# EasyEDA Pro project Temp_Con_V116.eprj, board TEMP_PWR
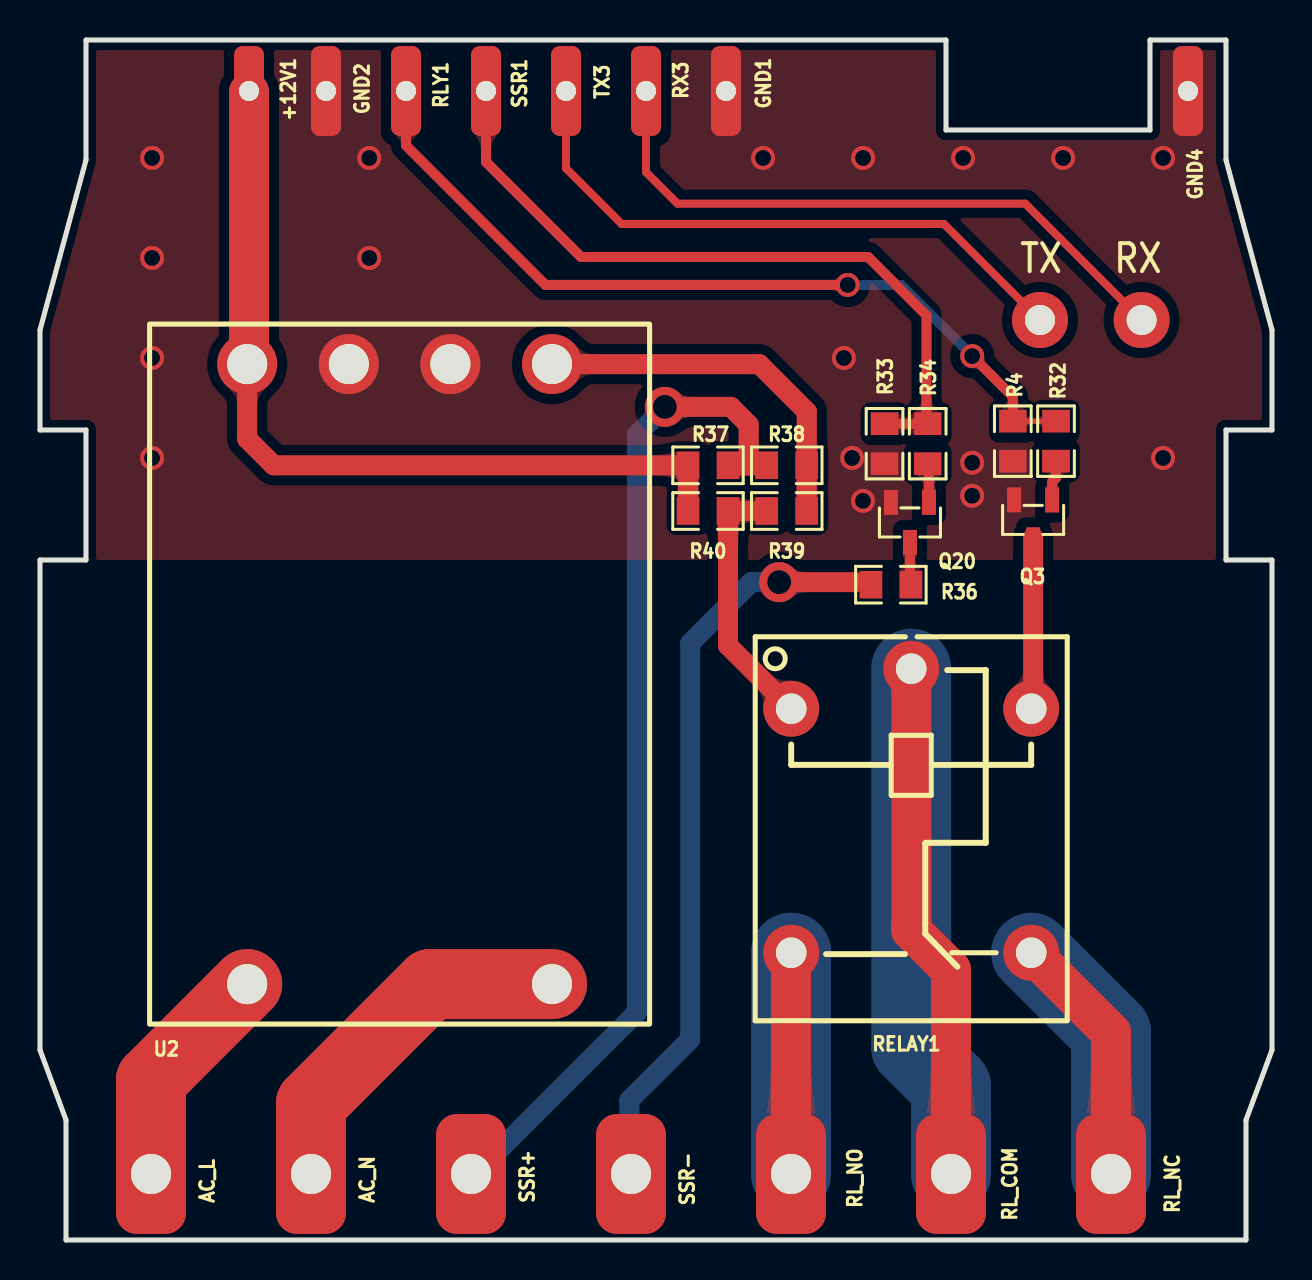
[diagram p10: board, top side]
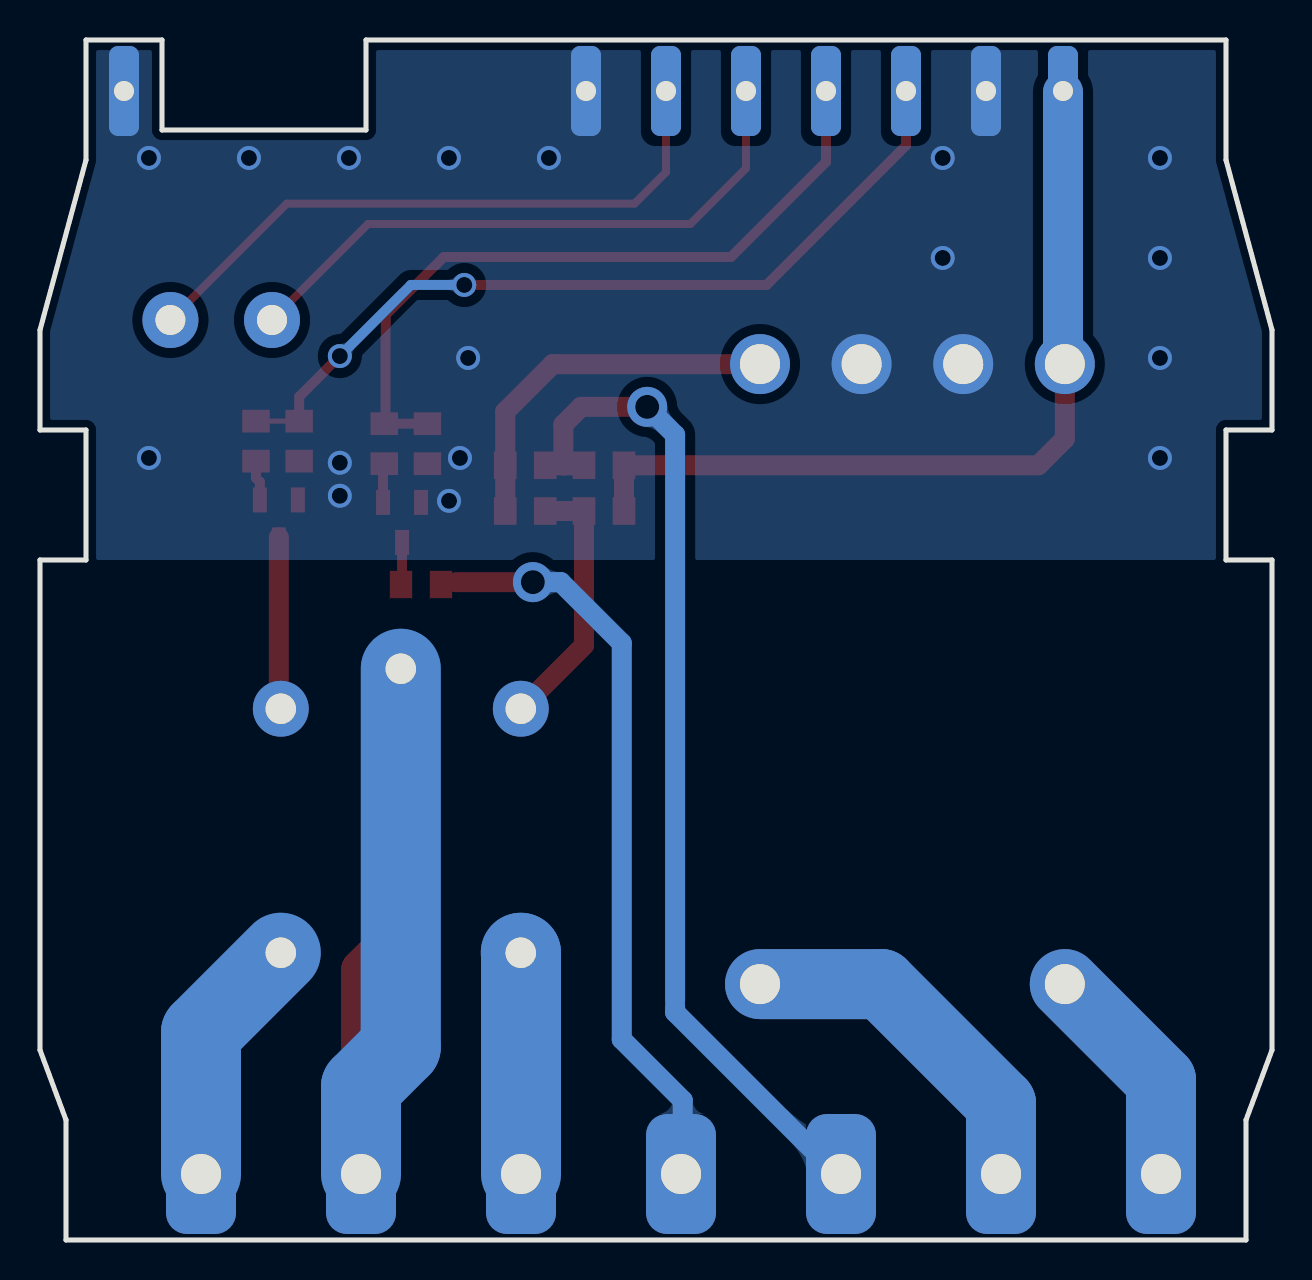
[diagram p11: board, bottom side, seen from below]

Outline 61.6 x 60 mm; copper layers: Top Layer, Bottom Layer. Coordinates in mm from the lower left corner of the outline.
Outline path: 0,45.5 0,40.5 2.3,40.5 2.3,34 0,34 0,9.5 1.3,6 1.3,0 60.3,0 60.3,6 61.6,9.5 61.6,34 59.3,34 59.3,40.5 61.6,40.5 61.6,45.5 59.3,54 59.3,60 55.5,60 55.5,55.5 45.3,55.5 45.3,60 2.3,60 2.3,54 0,45.5
Stack: Top Layer 0.035mm / Dielectric1 1.51mm FR4 er 4.5 / Bottom Layer 0.035mm

## Design rules (mm)
template: Custom Config
spacing copperThickness1oz (default): track to track 0.203, other pairs 0.201 to 0.305
track width copperThickness1oz (default): min 0.127, default 0.254, max 5
track width copperThickness2oz: min 0.203, default 0.254, max 2.54
differential pair differentialPair (default): width min 0.127, default 0.254, max 2.54; gap min 0.152, default 0.152
via viaSize (default): diameter min 0.5, default 0.8, max 10; hole min 0.5, default 0.5, max 10

## Placement (name value [footprint] x y rotation side)
+12V1  -  [S_FT]  10.45 57.45 180 top
AC_L  -  [B_FT]  5.55 3.3 0 top
AC_N  -  [B_FT]  13.55 3.3 0 top
GND1  -  [S_FT]  34.3 57.45 180 top
GND2  -  [S_FT]  14.3 57.45 180 top
GND4  -  [S_FT]  57.4 57.45 0 top
NOREF  -  [Pad_e107]  55.08 46 0 top
NOREF#2  -  [Pad_e106]  50 46 0 top
Q3  AO3400A  [SOT-23-3_L2.9-W1.3-P1.90-LS2.4-BR]  49.66 36 90 top
Q20  AO3400A  [SOT-23-3_L2.9-W1.3-P1.90-LS2.4-BR]  43.5 35.88 90 top
R4  10kΩ  [R0805]  48.64 39.94 90 top
R32  1kΩ  [R0805]  50.8 39.94 90 top
R33  10kΩ  [R0805]  42.23 39.81 90 top
R34  1kΩ  [R0805]  44.39 39.81 90 top
R36  0Ω  [R0805]  42.54 32.77 180 top
R37  0Ω  [R0805]  33.4 38.73 180 top
R38  0Ω  [R0805]  37.34 38.73 0 top
R39  0Ω  [R0805]  37.34 36.45 0 top
R40  0Ω  [R0805]  33.4 36.45 180 top
RELAY1  SRD-12VDC-SL-C  [RELAY-TH_SRD-XXVDC-XL-C]  43.56 21.46 270 top
RL_COM  -  [B_FT]  45.55 3.3 0 top
RL_NC  -  [B_FT]  53.55 3.3 0 top
RL_NO  -  [B_FT]  37.55 3.3 0 top
RLY1  -  [S_FT]  18.3 57.45 180 top
RX3  -  [S_FT]  30.3 57.45 180 top
SSR1  -  [S_FT]  22.3 57.45 180 top
SSR+  -  [B_FT]  21.55 3.3 0 top
SSR-  -  [B_FT]  29.55 3.3 0 top
TX3  -  [S_FT]  26.3 57.45 180 top
U2  -  [P_MOD1]  30.48 10.79 90 top

## Footprints (pads in the part's own frame, mm; a bottom-side part is the same pattern mirrored in y, then rotated)
B_FT
  rrect 3.5x6 hole 2x1.5: 1(0,0)
P_MOD1
  round 3 hole 2: 1(2,20.12) 2(2,4.88) 3(33,4.88) 4(33,9.96) 5(33,15.04) 6(33,20.12)
Pad_e106
  round 2.8 hole 1.5: 1(0,0)
Pad_e107
  round 2.8 hole 1.5: 2(0,0)
R0805
  rect 1.133x1.377 smd: 1(-1,0) 2(1,0)
RELAY-TH_SRD-XXVDC-XL-C
  round 2.794 hole 1.524: 1(-5.1,-6) 2(7.1,-6) 3(7.1,6) 4(-5.1,6) 5(-7.1,0)
S_FT
  rrect 1.5x4.5 hole 1: 1(0,0)
SOT-23-3_L2.9-W1.3-P1.90-LS2.4-BR
  rect 1.25x0.7 smd: 1(1,-0.95) 2(1,0.95) 3(-1,0)

## Nets
As in the schematic, except:
U3_RX: NOREF.2 RX3.1
U3_TX: NOREF#2.1 TX3.1

## Via types
v1: diameter 1.2, hole 0.8, Top Layer to Bottom Layer, 19 vias
v2: diameter 2, hole 1.2, Top Layer to Bottom Layer, 2 vias

## Routing (per net, layer and track width the routed paths; a pad name or vN(x,y) marks a point on that pad's centre or on a via; arc(x,y) is an arc through that point)
+5V: length 18.7
  Top Layer w1: 25.6,43.8 35.96,43.8 38.34,41.42 R38.2 R39.2
+12V: length 55.9
  Top Layer w1: 32.38,36.47 R40.2 R37.2 11.68,38.73 10.36,40.06 10.36,43.8
  Top Layer w2: 10.45,57.4 10.45,43.89 10.36,43.8
  Bottom Layer w2: 10.36,43.8 10.45,43.89 10.45,57.4
GND:
  vias: v1(5.6,54.1) v1(5.6,49.1) v1(5.6,44.1) v1(5.6,39.1) v1(16.46,54.1) v1(16.46,49.1) v1(36.15,54.1) v1(40.19,44.1) v1(40.6,39.1) v1(41.15,36.96) v1(41.15,54.1) v1(46.15,54.1) v1(46.61,38.86) v1(46.61,37.21) v1(51.15,54.1) v1(56.15,54.1) v1(56.15,39.1)
AC_L: length 23
  Top Layer w3.5: AC_L.1 5.55,7.99 10.36,12.8
  Bottom Layer w3.5: AC_L.1 5.55,7.99 10.36,12.8
AC_N: length 36.1
  Top Layer w3.5: AC_N.1 13.55,6.82 19.53,12.8 25.6,12.8
  Bottom Layer w3.5: 25.6,12.8 19.53,12.8 13.55,6.82 AC_N.1
RL_COM: length 52.2
  Top Layer w2: 43.56,28.56 43.56,15.49 45.55,13.5 RL_COM.1
  Bottom Layer w4: 43.56,28.56 43.56,9.65 45.55,7.66 RL_COM.1
RL_NC: length 25.4
  Top Layer w2: RELAY1.3 53.55,10.37 RL_NC.1
  Bottom Layer w4: RELAY1.3 53.55,10.37 RL_NC.1
RL_NO: length 22.1
  Top Layer w2: RELAY1.2 37.55,14.35 RL_NO.1
  Bottom Layer w4: RELAY1.2 37.55,14.35 RL_NO.1
RLY: length 41.7
  Top Layer w0.254: R4.2 R32.2
  Top Layer w0.5: RLY1.1 18.3,54.72 25.27,47.75 v1(40.39,47.75) ; R4.2 48.64,42.16 v1(46.61,44.2)
  Bottom Layer w0.5: v1(46.61,44.2) 43.05,47.75 v1(40.39,47.75)
SSR: length 36.7
  Top Layer w0.5: SSR1.1 22.3,53.9 27.05,49.15 41.41,49.15 44.32,46.23 44.32,41.2 43.94,40.81 ; 43.94,40.81 R34.2 ; 43.94,40.81 R33.2 ; 43.94,40.81 43.94,40.62
SSR+: length 50.7
  Top Layer w1: R37.1 35.43,38.73 ; 35.43,38.73 35.43,40.77 34.54,41.66 v2(31.24,41.66) ; 35.43,38.73 R38.1
  Bottom Layer w1: v2(31.24,41.66) 29.84,40.26 29.84,11.98 ; SSR+.1 21.76,3.3 29.84,11.39 29.84,11.68
SSR-: length 37.4
  Top Layer w1: 40.78,32.89 v2(36.96,32.89)
  Bottom Layer w1: SSR-.1 29.46,3.39 29.46,6.99 32.51,10.03 32.51,29.84 35.56,32.89 v2(36.96,32.89)
U3_RX: length 31.9
  Top Layer w0.4: NOREF.2 49.26,51.82 31.88,51.82 30.3,53.39 RX3.1
U3_TX: length 30.7
  Top Layer w0.4: TX3.1 26.3,53.58 29.08,50.8 45.2,50.8 NOREF#2.1
$1N448: length 8.6
  Top Layer w1: 49.66,35.13 49.66,26.66 49.56,26.56
$1N449: length 13.2
  Top Layer w1: 37.56,26.56 34.4,29.72 34.4,36.17 34.68,36.45 ; 34.68,36.45 R39.1 ; 34.68,36.45 R40.1
$1N452: length 2
  Top Layer w0.5: 50.61,37.13 50.61,37.91 50.8,38.1 50.8,39
$1N459: length 2
  Top Layer w0.5: Q20.1 44.45,38.75 R34.1
$1N1061: length 2.1
  Top Layer w0.5: R36.1 43.5,32.81 Q20.3

## Copper pours and planes (outline as drawn; the poured copper is in the pictures)
GND on Top Layer: 0,45.5 0,40.5 2.3,40.5 2.3,34 59.3,34 59.3,40.5 61.6,40.5 61.6,45.5 59.3,54 59.3,60 55.5,60 55.5,55.5 45.3,55.5 45.3,60 2.3,60 2.3,54
GND on Bottom Layer: 0,45.5 0,40.5 2.3,40.5 2.3,34 59.3,34 59.3,40.5 61.6,40.5 61.6,45.5 59.3,54 59.3,60 55.5,60 55.5,55.5 45.3,55.5 45.3,60 2.3,60 2.3,54

Small or netless copper shapes (teardrops, artwork), in the pictures only: 39 on Top Layer, 7 on Bottom Layer

## Text on the board
Top Silkscreen Layer: TX | RX
